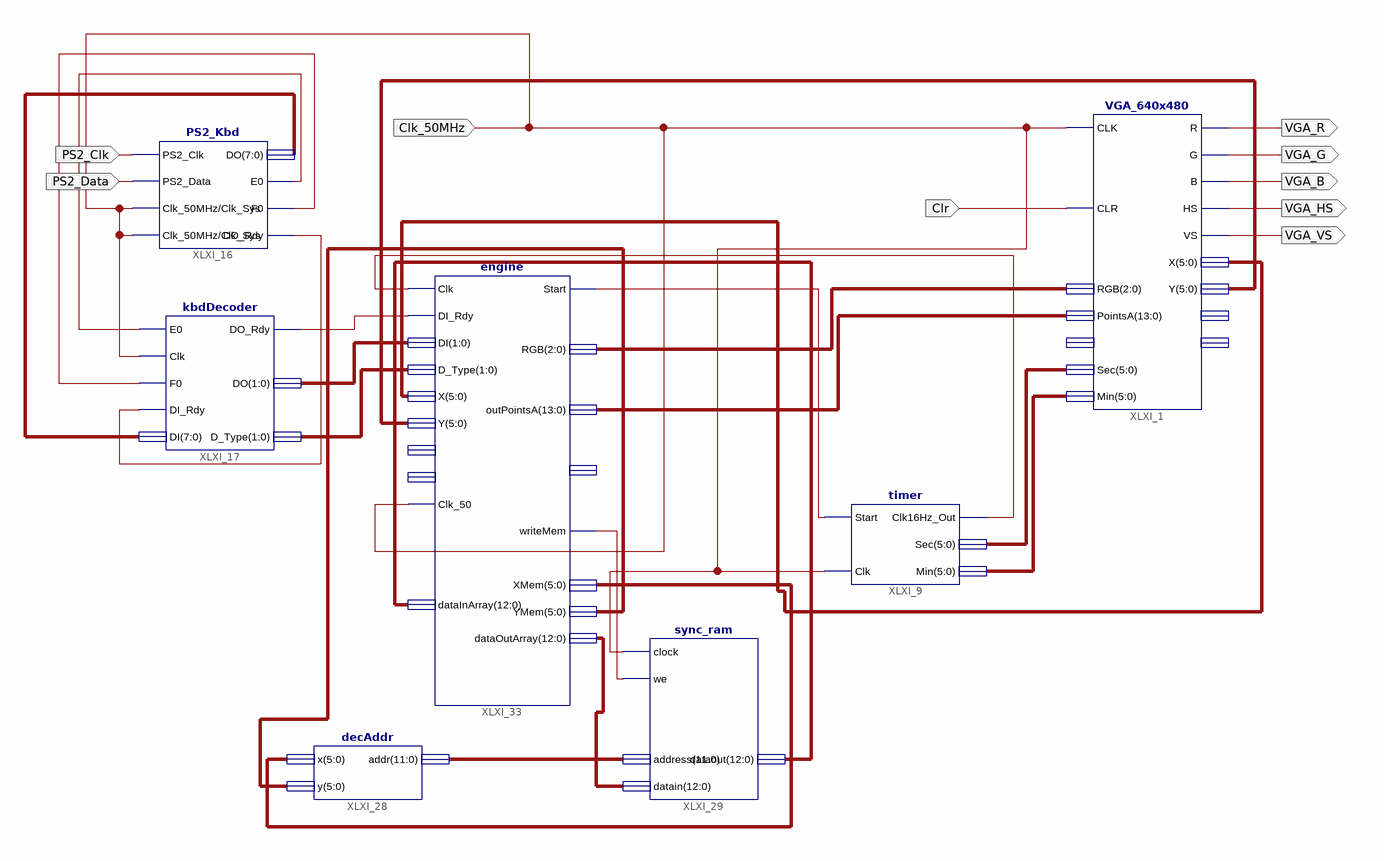
[diagram p0: schematic sheet 1]
// Xilinx ISE schematic main.sch (spartan3e) as structural Verilog: 7 symbols, 9 ports
module main (
  input  Clk_50MHz,
  input  Clr,
  input  PS2_Clk,
  input  PS2_Data,
  output VGA_R,
  output VGA_G,
  output VGA_B,
  output VGA_HS,
  output VGA_VS
);

  wire XLXN_20, XLXN_24, XLXN_29, XLXN_30, XLXN_31, XLXN_32, XLXN_40;
  wire [1:0] XLXN_33, XLXN_34;
  wire [2:0] XLXN_21;
  wire [5:0] XLXN_10, XLXN_11, XLXN_25, XLXN_26, XLXN_44, XLXN_45;
  wire [7:0] XLXN_27;
  wire [11:0] XLXN_35;
  wire [12:0] XLXN_42, XLXN_43;
  wire [13:0] XLXN_22;

  VGA_640x480 XLXI_1 (
    .CLK(Clk_50MHz), .CLR(Clr), .RGB(XLXN_21), .PointsA(XLXN_22), .Sec(XLXN_10), .Min(XLXN_11), .R(VGA_R),
    .G(VGA_G), .B(VGA_B), .HS(VGA_HS), .VS(VGA_VS), .X(XLXN_25), .Y(XLXN_26));  // open: PointsB, pixelX, pixelY
  timer XLXI_9 (.Start(XLXN_20), .Clk(Clk_50MHz), .Clk16Hz_Out(XLXN_24), .Sec(XLXN_10), .Min(XLXN_11));
  PS2_Kbd XLXI_16 (
    .PS2_Clk(PS2_Clk), .PS2_Data(PS2_Data), .Clk_50MHz(Clk_50MHz), .E0(XLXN_29), .F0(XLXN_30),
    .DO_Rdy(XLXN_31), .DO(XLXN_27), .Clk_Sys(Clk_50MHz));
  kbdDecoder XLXI_17 (
    .E0(XLXN_29), .Clk(Clk_50MHz), .F0(XLXN_30), .DI_Rdy(XLXN_31), .DI(XLXN_27), .DO_Rdy(XLXN_32),
    .DO(XLXN_33), .D_Type(XLXN_34));
  decAddr XLXI_28 (.x(XLXN_45), .y(XLXN_44), .addr(XLXN_35));
  sync_ram XLXI_29 (.clock(Clk_50MHz), .we(XLXN_40), .address(XLXN_35), .datain(XLXN_43), .dataout(XLXN_42));
  engine XLXI_33 (
    .Clk(XLXN_24), .Clk_50(Clk_50MHz), .DI_Rdy(XLXN_32), .DI(XLXN_33), .D_Type(XLXN_34), .X(XLXN_25),
    .Y(XLXN_26), .dataInArray(XLXN_42), .writeMem(XLXN_40), .Start(XLXN_20), .XMem(XLXN_45), .YMem(XLXN_44),
    .RGB(XLXN_21), .dataOutArray(XLXN_43), .outPointsA(XLXN_22));  // open: pixelX, pixelY, outPointsB
endmodule
